# Altium schematic sheet USB3.0.SchDoc: USB
size B
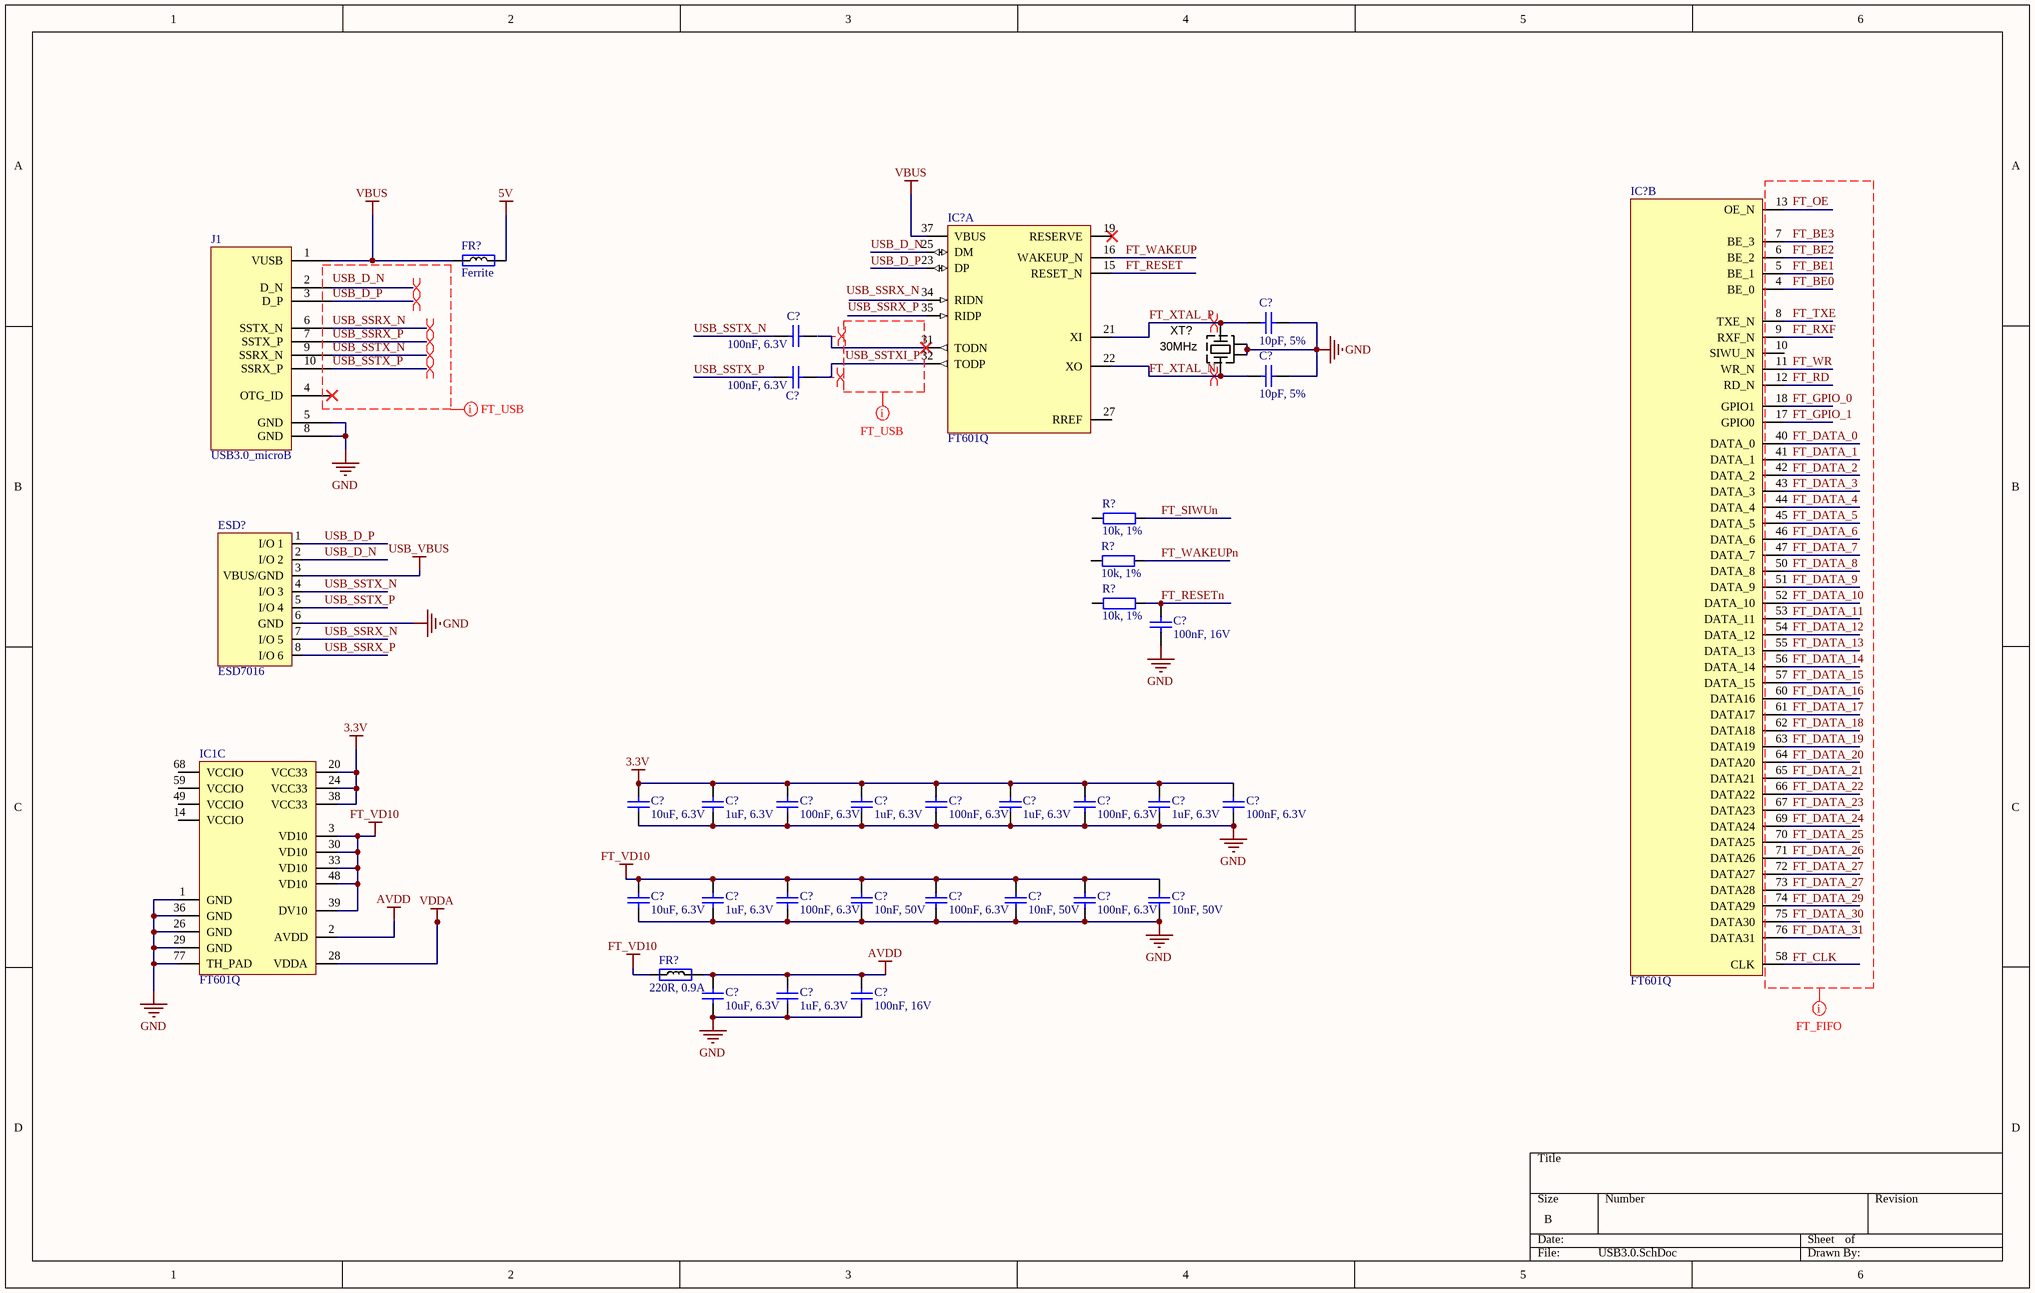
[diagram p0: USB3.0.SchDoc]

## Parts
(Parts that share a designator on the sheet are numbered #1, #2 ... from top to bottom, then left to right.)
C?#1  10pF, 5%  [CAP0402]
C?#2  100nF, 6.3V  [CAP0201]
C?#3  100nF, 6.3V  [CAP0201]
C?#4  10pF, 5%  [CAP0402]
C?#5  100nF, 16V  [CAP0402]
C?#6  10uF, 6.3V  [CAP0603]
C?#7  1uF, 6.3V  [CAP0201]
C?#8  100nF, 6.3V  [CAP0201]
C?#9  1uF, 6.3V  [CAP0201]
C?#10  100nF, 6.3V  [CAP0201]
C?#11  1uF, 6.3V  [CAP0201]
C?#12  100nF, 6.3V  [CAP0201]
C?#13  1uF, 6.3V  [CAP0201]
C?#14  100nF, 6.3V  [CAP0201]
C?#15  10uF, 6.3V  [CAP0603]
C?#16  1uF, 6.3V  [CAP0201]
C?#17  100nF, 6.3V  [CAP0201]
C?#18  10nF, 50V  [CAP0402]
C?#19  100nF, 6.3V  [CAP0201]
C?#20  10nF, 50V  [CAP0402]
C?#21  100nF, 6.3V  [CAP0201]
C?#22  10nF, 50V  [CAP0402]
C?#23  10uF, 6.3V  [CAP0603]
C?#24  1uF, 6.3V  [CAP0201]
C?#25  100nF, 16V  [CAP0402]
ESD?  ESD7016  [ESD7016]
FR?#1  Ferrite  [RES0402]
FR?#2  220R, 0.9A  [RES0402]
IC1  FT601Q  [FT601Q]  (part C of 3)
IC?#1  FT601Q  [FT601Q]  (part A of 3)
IC?#2  FT601Q  [FT601Q]  (part B of 3)
J1  USB3.0_microB
R?#1  10k, 1%  [RES0402]
R?#2  10k, 1%  [RES0402]
R?#3  10k, 1%  [RES0402]
XT?  30MHz  [CRYSTAL_4-LCC]

## Nets
3.3V: C?#6.2 C?#7.2 C?#8.1 C?#9.2 C?#10.1 C?#11.2 C?#12.1 C?#13.2 C?#14.1 IC1.20(VCC33) IC1.24(VCC33) IC1.38(VCC33)
5V: FR?#1.2
AVDD: C?#23.2 C?#24.2 C?#25.1 FR?#2.2 IC1.2(AVDD)
FT_VD10: C?#15.2 C?#16.2 C?#17.1 C?#18.1 C?#19.1 C?#20.1 C?#21.1 C?#22.1 FR?#2.1 IC1.3(VD10) IC1.30(VD10) IC1.33(VD10) IC1.39(DV10) IC1.48(VD10)
GND: C?#1.2 C?#4.2 C?#5.2 C?#6.1 C?#7.1 C?#8.2 C?#9.1 C?#10.2 C?#11.1 C?#12.2 C?#13.1 C?#14.2 C?#15.1 C?#16.1 C?#17.2 C?#18.2 C?#19.2 C?#20.2 C?#21.2 C?#22.2 C?#23.1 C?#24.1 C?#25.2 ESD?.6(GND) IC1.1(GND) IC1.26(GND) IC1.29(GND) IC1.36(GND) IC1.77(TH_PAD) J1.5(GND) J1.8(GND) XT?.2(GND) XT?.4(GND)
USB_VBUS: ESD?.3(VBUS/GND)
VBUS: FR?#1.1 IC?#1.37(VBUS) J1.1(VUSB)
VDDA: IC1.28(VDDA)
FT_BE0: IC?#2.4(BE_0)
FT_BE1: IC?#2.5(BE_1)
FT_BE2: IC?#2.6(BE_2)
FT_BE3: IC?#2.7(BE_3)
FT_DATA_0: IC?#2.40(DATA_0)
FT_DATA_1: IC?#2.41(DATA_1)
FT_DATA_2: IC?#2.42(DATA_2)
FT_DATA_3: IC?#2.43(DATA_3)
FT_DATA_4: IC?#2.44(DATA_4)
FT_DATA_5: IC?#2.45(DATA_5)
FT_DATA_6: IC?#2.46(DATA_6)
FT_DATA_7: IC?#2.47(DATA_7)
FT_DATA_8: IC?#2.50(DATA_8)
FT_DATA_9: IC?#2.51(DATA_9)
FT_DATA_10: IC?#2.52(DATA_10)
FT_DATA_11: IC?#2.53(DATA_11)
FT_DATA_12: IC?#2.54(DATA_12)
FT_DATA_13: IC?#2.55(DATA_13)
FT_DATA_14: IC?#2.56(DATA_14)
FT_DATA_15: IC?#2.57(DATA_15)
FT_DATA_16: IC?#2.60(DATA16)
FT_DATA_17: IC?#2.61(DATA17)
FT_DATA_18: IC?#2.62(DATA18)
FT_DATA_19: IC?#2.63(DATA19)
FT_DATA_20: IC?#2.64(DATA20)
FT_DATA_21: IC?#2.65(DATA21)
FT_DATA_22: IC?#2.66(DATA22)
FT_DATA_23: IC?#2.67(DATA23)
FT_DATA_24: IC?#2.69(DATA24)
FT_DATA_25: IC?#2.70(DATA25)
FT_DATA_26: IC?#2.71(DATA26)
FT_DATA_27: IC?#2.72(DATA27) IC?#2.73(DATA28)
FT_DATA_29: IC?#2.74(DATA29)
FT_DATA_30: IC?#2.75(DATA30)
FT_DATA_31: IC?#2.76(DATA31)
FT_GPIO_0: IC?#2.18(GPIO1)
FT_GPIO_1: IC?#2.17(GPIO0)
FT_OE: IC?#2.13(OE_N)
FT_RD: IC?#2.12(RD_N)
FT_RESET: IC?#1.15(RESET_N)
FT_RESETn: C?#5.1 R?#3.1
FT_RXF: IC?#2.9(RXF_N)
FT_SIWUn: R?#1.1
FT_TXE: IC?#2.8(TXE_N)
FT_WAKEUP: IC?#1.16(WAKEUP_N)
FT_WAKEUPn: R?#2.1
FT_WR: IC?#2.11(WR_N)
FT_XTAL_N: C?#4.1 IC?#1.22(XO) XT?.1(X)
FT_XTAL_P: C?#1.1 IC?#1.21(XI) XT?.3(X)
USB_D_N: ESD?.2(I/O_2) IC?#1.25(DM)
USB_D_P: ESD?.1(I/O_1) IC?#1.23(DP) J1.3(D_P)
USB_SSRX_N: ESD?.7(I/O_5) J1.6(SSTX_N)
USB_SSRX_P: ESD?.8(I/O_6) J1.7(SSTX_P)
USB_SSTX_N: C?#2.1 ESD?.4(I/O_3) J1.9(SSRX_N)
USB_SSTX_P: C?#3.1 ESD?.5(I/O_4) J1.10(SSRX_P)
NetC?#3_2: C?#3.2 IC?#1.32(TODP)

Not connected (* = marked no-connect by the designer): C?#2 2; IC1 14(VCCIO) 49(VCCIO) 59(VCCIO) 68(VCCIO); IC?#1 19(RESERVE)* 27(RREF) 31(TODN)* 34(RIDN) 35(RIDP); IC?#2 10(SIWU_N) 58(CLK); J1 2(D_N) 4(OTG_ID)*; R?#1 2; R?#2 2; R?#3 2

## Layout directives
differential pair: FT_XTAL_N, FT_XTAL_P, NetC?#3_2, NetIC?#1_31, NetJ1_2, USB_D_P, USB_SSRX_N, USB_SSRX_P, USB_SSTX_N, USB_SSTX_P
net class Undefined: FT_BE0, FT_BE1, FT_BE2, FT_BE3, FT_CLK, FT_DATA_0, FT_DATA_1, FT_DATA_2, FT_DATA_3, FT_DATA_4, FT_DATA_5, FT_DATA_6, FT_DATA_7, FT_DATA_8, FT_DATA_9, FT_DATA_10, FT_DATA_11, FT_DATA_12, FT_DATA_13, FT_DATA_14, FT_DATA_15, FT_DATA_16, FT_DATA_17, FT_DATA_18, FT_DATA_19, FT_DATA_20, FT_DATA_21, FT_DATA_22, FT_DATA_23, FT_DATA_24, FT_DATA_25, FT_DATA_26, FT_DATA_27, FT_DATA_29, FT_DATA_30, FT_DATA_31, FT_GPIO_0, FT_GPIO_1, FT_OE, FT_RD, FT_RXF, FT_TXE, FT_WR, USB_D_N, USB_D_P, USB_SSRX_N, USB_SSRX_P, USB_SSTX_N, USB_SSTX_P, USB_SSTXI_P

## Notes on the sheet
- Labels drawn without touching a wire or pin: FT_CLK, USB_D_N, USB_SSRX_N, USB_SSRX_P, USB_SSTXI_P

## Library data of the parts
C?#1 C?#4 = Cap_0402: Manufacturer: AVX; Manufacturer Part Number 1: 04023A100JAT2A; Part Description: 10pF ±5% 25V C0G, NP0 Ceramic Capacitor -55°C ~ 125°C Surface Mount, MLCC 0402 (1005 Metric) 0.039" L x 0.020" W (1.00mm x 0.50mm); Capacitance: 10; Ceramic Capacitor Case: 0402 [1005 Metric]; Capacitor Case Style: 0402 [1005 Metric]<!--FANDB--><div class="features-and-benefits-container"></div>; Voltage Rating: 25; Supplier 1: Farnell; Supplier Part Number 1: 2332478RL; Capacitance Tolerance: ± 5%; value: 10pF, 5%; Capacitance Tolerance ±: ± 5%; MSL: MSL 1 - Unlimited; Operating Temperature Max: 125; Operating Temperature Min: -55; Packaging: Cut Tape
C?#2 C?#3 C?#8 C?#10 C?#12 C?#14 C?#17 C?#19 C?#21 = Cap_0402: Manufacturer: Murata; Manufacturer Part Number 1: GRT033C81A104KE01D; Part Description: 0.10µF ±10% 6.3V X6S Ceramic Capacitor -55°C ~ 105°C Surface Mount, MLCC 0201 (0603 Metric) 0.024" L x 0.012" W (0.60mm x 0.30mm); Capacitance: 0.1 uF; Dielectric: X6S; Brand: Murata Electronics; Type: Voltage and Temperature Derating Recommended Product; Voltage Rating DC: 6.3 VDC; Product Status: New Product; Tolerance: 10 %; Value: 100nF, 6.3V; Package / Case: 0201 (0603 metric); Width: 0.3 mm; Minimum Order Quantity: 1; Category: Multilayer Ceramic Capacitors MLCC - SMD/SMT; Termination Style: SMD/SMT; Case Code - mm: 0603; Maximum Operating Temperature: + 125 C; Length: 0.6 mm; Product: General Type MLCCs; Case Code - in: 0201; RoHS: RoHS Compliant; Minimum Operating Temperature: - 55 C; RoHS - Mouser: Y; Height: 0.3 mm; Packaging: Reel; Series: GRM; Reeling: True; Supplier 1: Digi-Key; Supplier Part Number 1: 490-12232-1-ND
C?#5 = Cap_0603: Manufacturer Part Number 1: GRM155R71C104KA88D; Part Description: 0.10µF ±10% 16V X7R Ceramic Capacitor -55°C ~ 125°C Surface Mount, MLCC 0402 (1005 Metric) 0.039" L x 0.020" W (1.00mm x 0.50mm); Brand: Murata Electronics; Tolerance: 10 %; Type: General Purpose MLCC; Capacitance: 0.1 uF; Temperature Coefficient / Code: +/- 15 %; Case Height: 0.5 mm; Case Length: 1 mm; Dielectric: X7R; Supplier 1: Mouser; Supplier Part Number 1: 81-GRM155R71C104KA88; Case Code - in: 0402; Manufacturer: Murata Electronics; Category: Multilayer Ceramic Capacitors MLCC - SMD/SMT; Voltage Rating DC: 16 V; Value: 100nF, 16V; Manufacturer Part Number: GRM155R71C104KA88D; Case Code - mm: 1005; Case Width: 0.5 mm; Maximum Operating Temperature: + 125 C; Minimum Operating Temperature: - 55 C; Minimum Order Quantity: 1; Operating Temperature Range: - 55 C to + 125 C; Package / Case: 0402 (1005 metric); Packaging: Reel; Product: General Type MLCCs; Product Category: Low & Medium Capacitance SMD Ceramic Chip Capacitors; Reeling: True; RoHS - Mouser: Y; RoHS: RoHS Compliant; Series: GRM; Standard Pack Qty: 10000; Termination Style: SMD/SMT
C?#6 C?#15 C?#23 = Cap_0603: Manufacturer Part Number 1: CC0603MRX5R5BB106; Manufacturer: Yageo; Part Description: 10µF ±20% 6.3V X5R Ceramic Capacitor -55°C ~ 85°C Surface Mount, MLCC 0603 (1608 Metric) 0.063" L x 0.031" W (1.60mm x 0.80mm); Capacitance: 10µF; Tolerance: ±20%; Supplier 1: Digi-Key; Supplier Part Number 1: 311-1448-2-ND; Package / Case: 0603 (1608 Metric); Category: Capacitors; Voltage - Rated: 6.3V; Value: 10uF, 6.3V
C?#7 C?#9 C?#11 C?#13 C?#16 C?#24 = Cap_0402: Manufacturer: TDK Corporation; Manufacturer Part Number 1: JMK063ABJ105MP-F; Part Description: 1µF ±20% 6.3V X5R Ceramic Capacitor -55°C ~ 85°C Surface Mount, MLCC 0201 (0603 Metric) 0.024" L x 0.012" W (0.60mm x 0.30mm); Tolerance: ±20%; Capacitance: 1.0µF; Temperature Coefficient: X5R; Value: 1uF, 6.3V; Supplier 1: Digi-Key; Supplier Part Number 1: 587-5864-2-ND; Applications: General Purpose; Features: -; Lead Style: -; Ratings: -; Thickness (Max): -; Lead Spacing: -; Height - Seated (Max): -; Size / Dimension: 0.024" L x 0.012" W (0.60mm x 0.30mm); Mounting Type: Surface Mount, MLCC; Operating Temperature: -55°C ~ 85°C; Package / Case: 0201 (0603 Metric); Packaging: Cut Tape (CT); Voltage - Rated: 6.3V; Category: Capacitors; RoHS: RoHS Compliant
C?#18 C?#20 C?#22 = Cap_0402: Part Description: 10000pF ±10% 50V Ceramic Capacitor X7R 0402 (1005 Metric); Manufacturer: Murata Electronics North America; Manufacturer Part Number 1: GRM155R71H103KA88D; Tolerance: ±10%; Temperature Coefficient: X7R; Value: 10nF, 50V; Supplier 1: Digi-Key; Supplier Part Number 1: 490-4516-2-ND; RoHS: RoHS Compliant; Category: Capacitors; Stock 1: 10970000; Pricing 1: 10000=0.00185, 20000=0.00176, 30000=0.00167 (USD); Packaging: Tape & Reel (TR); Part Status: Active; Voltage - Rated: 50V; Operating Temperature: -55°C ~ 125°C; Features: -; Ratings: -; Applications: General Purpose; Mounting Type: Surface Mount, MLCC; Package / Case: 0402 (1005 Metric); Size / Dimension: 0.039" L x 0.020" W (1.00mm x 0.50mm); Height - Seated (Max): -; Thickness (Max): 0.022" (0.55mm); Lead Spacing: -; Lead Style: -; ComponentLink1URL: http://www.murata.com/~/media/webrenewal/support/library/catalog/products/capacitor/mlcc/c02e.ashx?la=en-us; ComponentLink1Description: http://www.murata.com/~/media/webrenewal/support/library/catalog/products/capacitor/mlcc/c02e.ashx?la=en-us
C?#25 = Cap_0402: Manufacturer: Murata Electronics; Manufacturer Part Number: GRM155R71C104KA88D; Part Description: 0.10µF ±10% 16V X7R Ceramic Capacitor -55°C ~ 125°C Surface Mount, MLCC 0402 (1005 Metric) 0.039" L x 0.020" W (1.00mm x 0.50mm); Tolerance: 10 %; Type: General Purpose MLCC; Capacitance: 0.1 uF; Case Length: 1 mm; Dielectric: X7R; Case Height: 0.5 mm; Temperature Coefficient / Code: +/- 15 %; Value: 100nF, 16V; Supplier 1: Mouser; Supplier Part Number 1: 81-GRM155R71C104KA88; Case Code - in: 0402; RoHS: RoHS Compliant; Operating Temperature Range: - 55 C to + 125 C; Series: GRM; Termination Style: SMD/SMT; Package / Case: 0402 (1005 metric); Voltage Rating DC: 16 V; Maximum Operating Temperature: + 125 C; Case Code - mm: 1005; Minimum Operating Temperature: - 55 C; Product Category: Low & Medium Capacitance SMD Ceramic Chip Capacitors; Packaging: Reel; Product: General Type MLCCs; Category: Multilayer Ceramic Capacitors MLCC - SMD/SMT; Brand: Murata Electronics; Case Width: 0.5 mm; RoHS - Mouser: Y; Standard Pack Qty: 10000; Minimum Order Quantity: 1; Reeling: True; Manufacturer Part Number 1: GRM155R71C104KA88D
ESD? = ESD7016: Manufacturer Part Number 1: ESD7016MUTAG; Manufacturer: ON Semiconductor; Part Description: TVS DIODE 5VWM 10VC 8UDFN; Unidirectional Channels: 8; Capacitance @ Frequency: 0.15pF @ 1MHz; Power Line Protection: No; Voltage - Reverse Standoff (Typ): 5V (Max); Voltage - Breakdown (Min): 5.5V; Current - Peak Pulse (10/1000µs): 1A (8/20µs); Voltage - Clamping (Max) @ Ipp: 10V; Supplier 1: Digi-Key; Category: Circuit Protection; RoHS: RoHS Compliant; Bidirectional Channels: -; Packaging: Digi-Reel®; Type: Zener; Operating Temperature: -55°C ~ 125°C (TJ); Mounting Type: Surface Mount; Power - Peak Pulse: -; Package / Case: 8-UFSFN; Supplier Device Package: 8-UDFN (3.3x1.0); Applications: General Purpose; Supplier Part Number 1: ESD7016MUTAGOSDKR-ND
FR?#2 = Ferrite: Manufacturer: TDK Corporation; Manufacturer Part Number 1: MPZ1005S221ET000; Part Description: FERRITE BEAD 220 OHM 0402 1LN; Impedance @ Frequency: 220 Ohm @ 100MHz; Current Rating: 900mA; DC Resistance (DCR): 220 mOhm Max; Supplier 1: Digi-Key; Package / Case: 0402 (1005 Metric); Category: Filters; Supplier Part Number 1: 445-9329-2-ND; Value: 220R, 0.9A
IC1 IC?#1 IC?#2 = FT601Q: Manufacturer: FTDI, Future Technology Devices International Ltd; Manufacturer Part Number 1: FT601Q-T; Function: Bridge, USB to FIFO; Standards: USB 3.0; Voltage - Supply: 1.65 V ~ 3.6 V; Protocol: USB; Interface: FIFO; Supplier 1: Digi-Key; Operating Temperature: -40°C ~ 85°C; Packaging: Tray; Category: Integrated Circuits (ICs); Package / Case: 76-VFQFN Exposed Pad; Supplier Device Package: 76-QFN (9x9); Current - Supply: -; RoHS: RoHS Compliant; Supplier Part Number 1: 768-1252-ND
R?#1-R?#3 = Res_0402: Manufacturer: Yageo; Manufacturer Part Number 1: RC0402FR-0710KL; Part Description: RES SMD 10K OHM 1% 1/16W 0402; Temperature Coefficient: ±100ppm/°C; Power (Watts): 0.063W, 1/16W; Value: 10k, 1%; Supplier 1: Digi-Key; Supplier Part Number 1: 311-10.0KLRTR-ND; Resistance (Ohms): 10k; Packaging: Tape & Reel (TR); RoHS: RoHS Compliant; Package / Case: 0402 (1005 Metric); Operating Temperature: -55°C ~ 155°C; Size / Dimension: 0.039" L x 0.020" W (1.00mm x 0.50mm); Number of Terminations: 2; Category: Resistors; Height: 0.016" (0.40mm); Supplier Device Package: 0402; Features: Moisture Resistant; Composition: Thick Film
  R?#1 R?#2: Tolerance: ±1%
XT? = CRYSTAL_19M2: Oscillator Crystal 25 MHz; Manufacturer: AVX Corp/Kyocera Corp; Manufacturer Part Number: CX3225SB30000D0FPLCC; Part Description: 30MHz ±10ppm Crystal 8pF 50 Ohm -40°C ~ 85°C Surface Mount 4-SMD, No Lead (DFN, LCC); Operating Mode: Fundamental; Frequency Tolerance: ±10ppm; Frequency Stability: ±20ppm; Load Capacitance: 8pF; ESR (Equivalent Series Resistance): 50 Ohm; Height: 0.024" (0.60mm); Size / Dimension: 0.126" L x 0.098" W (3.20mm x 2.50mm); Mounting Type: Surface Mount; Package / Case: 4-SMD, No Lead (DFN, LCC); Category: Crystals and Oscillators; Ratings: -; Supplier 1: Digi-Key; Operating Temperature: -40°C ~ 85°C; Packaging: Cut Tape (CT); RoHS: RoHS Compliant; Type: MHz Crystal; Supplier Part Number 1: 1253-1368-1-ND; Frequency: 30MHz; Value: 30MHz